# Altium schematic sheet Sheet2.SchDoc
size 840 x 594 mm; Scale: 1:1; Разраб.: Тимофеев; Обозначение документа: 5759-05-12-20 УП6359 Э3; Пров.: Никоноров; Утв.: Токарев; Наименование организации: ООО "ПО"Зарница"; Перв. применение: 5759-05-12-20 УП6359; Наименование изделия 1: Uni_mp3_v2_00; Наименование изделия 2: Схема электрическая; Наименование изделия 3: принципиальная; Нач. отд.: Нач. отд.; Фамилия нач. отд.: Никоноров
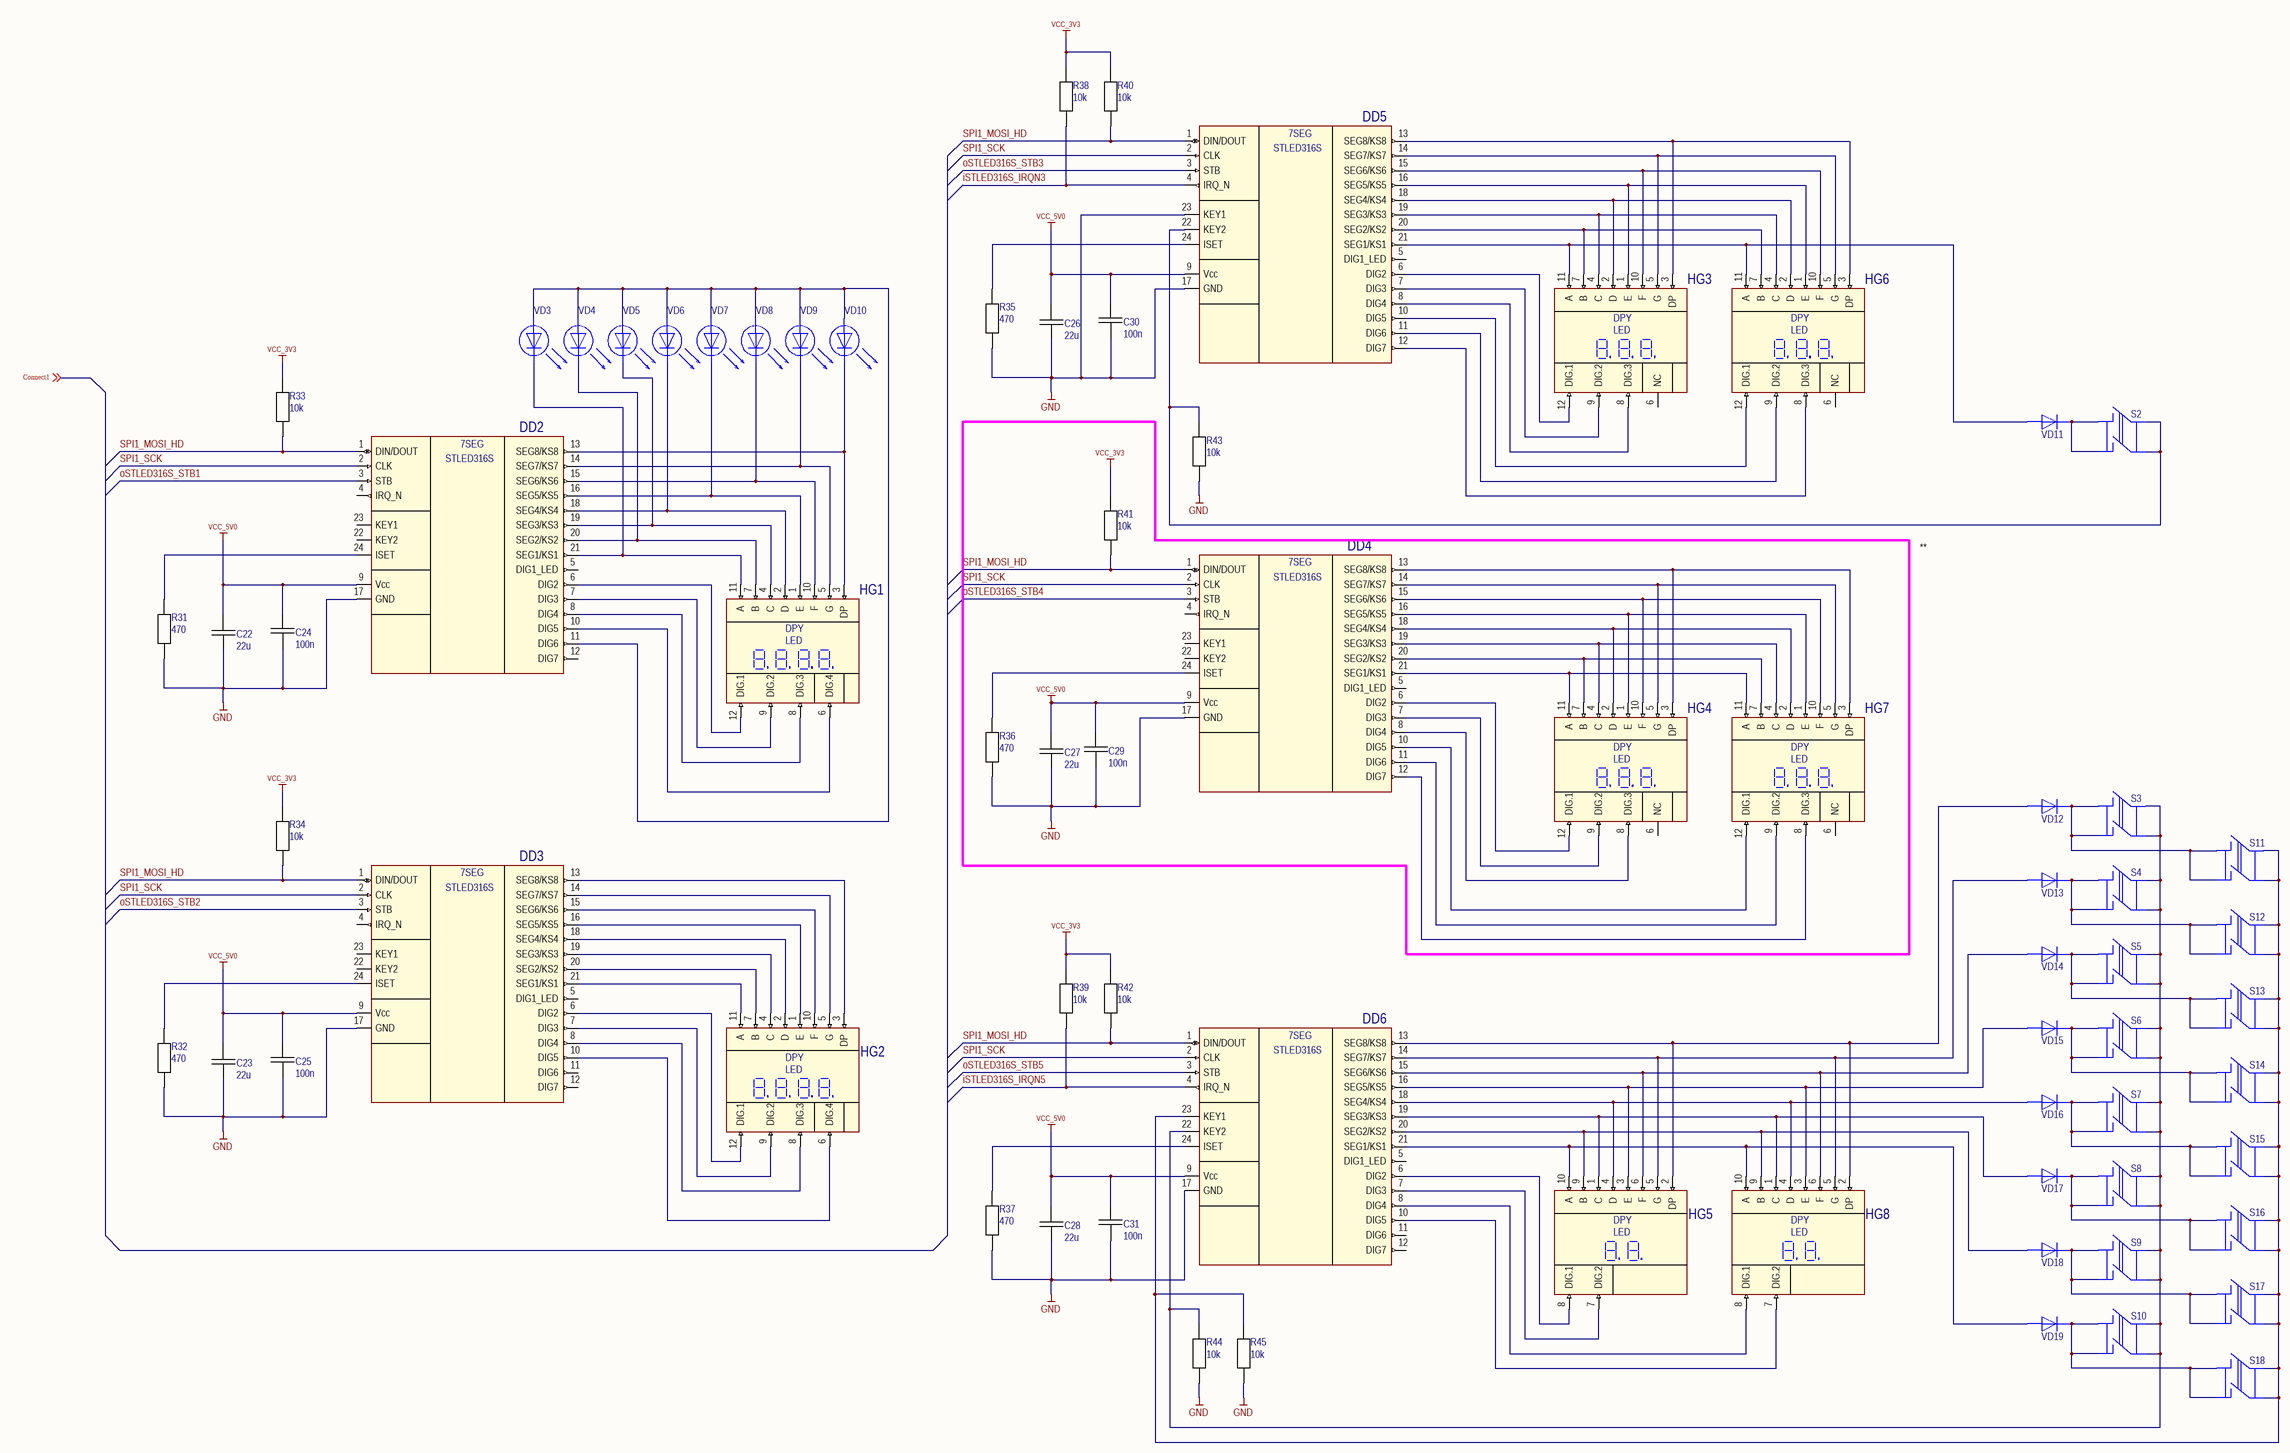
[diagram p0: Sheet2.SchDoc]

## Parts
C22  22u  [CAPACITOR_1206]
C23  22u  [CAPACITOR_1206]
C24  100n  [Capacitor_0805]
C25  100n  [Capacitor_0805]
C26  22u  [CAPACITOR_1206]
C27  22u  [CAPACITOR_1206]
C28  22u  [CAPACITOR_1206]
C29  100n  [Capacitor_0805]
C30  100n  [Capacitor_0805]
C31  100n  [Capacitor_0805]
DD2  STLED316S  [SO-24]  (value not drawn)
DD3  STLED316S  [SO-24]  (value not drawn)
DD4  STLED316S  [SO-24]  (value not drawn)
DD5  STLED316S  [SO-24]  (value not drawn)
DD6  STLED316S  [SO-24]  (value not drawn)
HG1  FYQ-5641BG-21  [FYQ-5641BG-21]  (value not drawn)
HG2  FYQ-5641BG-21  [FYQ-5641BG-21]  (value not drawn)
HG3  FYT-5631Bx  [FYT-5631Bx]  (value not drawn)
HG4  FYT-5631Bx  (value not drawn)
HG5  FYD-5621Bx  [FYD-5621Bx]  (value not drawn)
HG6  FYT-5631Bx  [FYT-5631Bx]  (value not drawn)
HG7  FYT-5631Bx  (value not drawn)
HG8  FYD-5621Bx  [FYD-5621Bx]  (value not drawn)
R31  470  [RESISTOR_SMD0805]
R32  470  [RESISTOR_SMD0805]
R33  10k  [RESISTOR_SMD0805]
R34  10k  [RESISTOR_SMD0805]
R35  470  [RESISTOR_SMD0805]
R36  470  [RESISTOR_SMD0805]
R37  470  [RESISTOR_SMD0805]
R38  10k  [RESISTOR_SMD0805]
R39  10k  [RESISTOR_SMD0805]
R40  10k  [RESISTOR_SMD0805]
R41  10k  [RESISTOR_SMD0805]
R42  10k  [RESISTOR_SMD0805]
R43  10k  [RESISTOR_SMD0805]
R44  10k  [RESISTOR_SMD0805]
R45  10k  [RESISTOR_SMD0805]
S2  DTS-26 12x12x9.5  [Tact Switch_DTS-26_12x12x95]  (value not drawn)
S3  DTS-26 12x12x9.5  [Tact Switch_DTS-26_12x12x95]  (value not drawn)
S4  DTS-26 12x12x9.5  [Tact Switch_DTS-26_12x12x95]  (value not drawn)
S5  DTS-26 12x12x9.5  [Tact Switch_DTS-26_12x12x95]  (value not drawn)
S6  DTS-26 12x12x9.5  [Tact Switch_DTS-26_12x12x95]  (value not drawn)
S7  DTS-26 12x12x9.5  [Tact Switch_DTS-26_12x12x95]  (value not drawn)
S8  DTS-26 12x12x9.5  [Tact Switch_DTS-26_12x12x95]  (value not drawn)
S9  DTS-26 12x12x9.5  [Tact Switch_DTS-26_12x12x95]  (value not drawn)
S10  DTS-26 12x12x9.5  [Tact Switch_DTS-26_12x12x95]  (value not drawn)
S11  DTS-26 12x12x9.5  [Tact Switch_DTS-26_12x12x95]  (value not drawn)
S12  DTS-26 12x12x9.5  [Tact Switch_DTS-26_12x12x95]  (value not drawn)
S13  DTS-26 12x12x9.5  [Tact Switch_DTS-26_12x12x95]  (value not drawn)
S14  DTS-26 12x12x9.5  [Tact Switch_DTS-26_12x12x95]  (value not drawn)
S15  DTS-26 12x12x9.5  [Tact Switch_DTS-26_12x12x95]  (value not drawn)
S16  DTS-26 12x12x9.5  [Tact Switch_DTS-26_12x12x95]  (value not drawn)
S17  DTS-26 12x12x9.5  [Tact Switch_DTS-26_12x12x95]  (value not drawn)
S18  DTS-26 12x12x9.5  [Tact Switch_DTS-26_12x12x95]  (value not drawn)
VD3  LED_FYL-3014GD1A  (value not drawn)
VD4  LED_FYL-3014GD1A  (value not drawn)
VD5  LED_FYL-3014GD1A  (value not drawn)
VD6  LED_FYL-3014GD1A  (value not drawn)
VD7  LED_FYL-3014GD1A  [LED_ FYL-3014GD1A]  (value not drawn)
VD8  LED_FYL-3014GD1A  [LED_ FYL-3014GD1A]  (value not drawn)
VD9  LED_FYL-3014GD1A  [LED_ FYL-3014GD1A]  (value not drawn)
VD10  LED_FYL-3014GD1A  [LED_ FYL-3014GD1A]  (value not drawn)
VD11  MMSD4148  [Diode_MMSD4148]  (value not drawn)
VD12  MMSD4148  [Diode_MMSD4148]  (value not drawn)
VD13  MMSD4148  [Diode_MMSD4148]  (value not drawn)
VD14  MMSD4148  [Diode_MMSD4148]  (value not drawn)
VD15  MMSD4148  [Diode_MMSD4148]  (value not drawn)
VD16  MMSD4148  [Diode_MMSD4148]  (value not drawn)
VD17  MMSD4148  [Diode_MMSD4148]  (value not drawn)
VD18  MMSD4148  [Diode_MMSD4148]  (value not drawn)
VD19  MMSD4148  [Diode_MMSD4148]  (value not drawn)

## Nets
GND: C22.2 C23.2 C24.1 C25.1 C26.2 C27.2 C28.2 C29.1 C30.1 C31.1 DD2.17(GND) DD3.17(GND) DD4.17(GND) DD5.17(GND) DD5.23(KEY1) DD6.17(GND) R31.1 R32.1 R35.1 R36.1 R37.1 R43.1 R44.1 R45.1
VCC_3V3: R33.2 R34.2 R38.2 R39.2 R40.2 R41.2 R42.2
VCC_5V0: C22.1 C23.1 C24.2 C25.2 C26.1 C27.1 C28.1 C29.2 C30.2 C31.2 DD2.9(Vcc) DD3.9(Vcc) DD4.9(Vcc) DD5.9(Vcc) DD6.9(Vcc)
iSTLED316S_IRQN3: DD5.4(IRQ_N) R38.1
iSTLED316S_IRQN5: DD6.4(IRQ_N) R39.1
oSTLED316S_STB1: DD2.3(STB)
oSTLED316S_STB2: DD3.3(STB)
oSTLED316S_STB3: DD5.3(STB)
oSTLED316S_STB4: DD4.3(STB)
oSTLED316S_STB5: DD6.3(STB)
SPI1_MOSI_HD: DD2.1(DIN/DOUT) DD3.1(DIN/DOUT) DD4.1(DIN/DOUT) DD5.1(DIN/DOUT) DD6.1(DIN/DOUT) R33.1 R34.1 R40.1 R41.1 R42.1
SPI1_SCK: DD2.2(CLK) DD3.2(CLK) DD4.2(CLK) DD5.2(CLK) DD6.2(CLK)
NetDD2_6: DD2.6(DIG2) HG1.12(DIG.1)
NetDD2_7: DD2.7(DIG3) HG1.9(DIG.2)
NetDD2_8: DD2.8(DIG4) HG1.8(DIG.3)
NetDD2_10: DD2.10(DIG5) HG1.6(DIG.4)
NetDD2_11: DD2.11(DIG6) VD3.2 VD4.2 VD5.2 VD6.2 VD7.2 VD8.2 VD9.2 VD10.2
NetDD2_13: DD2.13(SEG8/KS8) HG1.3(DP) VD10.1
NetDD2_14: DD2.14(SEG7/KS7) HG1.5(G) VD9.1
NetDD2_15: DD2.15(SEG6/KS6) HG1.10(F) VD8.1
NetDD2_16: DD2.16(SEG5/KS5) HG1.1(E) VD7.1
NetDD2_18: DD2.18(SEG4/KS4) HG1.2(D) VD6.1
NetDD2_19: DD2.19(SEG3/KS3) HG1.4(C) VD5.1
NetDD2_20: DD2.20(SEG2/KS2) HG1.7(B) VD4.1
NetDD2_21: DD2.21(SEG1/KS1) HG1.11(A) VD3.1
NetDD2_24: DD2.24(ISET) R31.2
NetDD3_6: DD3.6(DIG2) HG2.12(DIG.1)
NetDD3_7: DD3.7(DIG3) HG2.9(DIG.2)
NetDD3_8: DD3.8(DIG4) HG2.8(DIG.3)
NetDD3_10: DD3.10(DIG5) HG2.6(DIG.4)
NetDD3_13: DD3.13(SEG8/KS8) HG2.3(DP)
NetDD3_14: DD3.14(SEG7/KS7) HG2.5(G)
NetDD3_15: DD3.15(SEG6/KS6) HG2.10(F)
NetDD3_16: DD3.16(SEG5/KS5) HG2.1(E)
NetDD3_18: DD3.18(SEG4/KS4) HG2.2(D)
NetDD3_19: DD3.19(SEG3/KS3) HG2.4(C)
NetDD3_20: DD3.20(SEG2/KS2) HG2.7(B)
NetDD3_21: DD3.21(SEG1/KS1) HG2.11(A)
NetDD3_24: DD3.24(ISET) R32.2
NetDD4_6: DD4.6(DIG2) HG4.12(DIG.1)
NetDD4_7: DD4.7(DIG3) HG4.9(DIG.2)
NetDD4_8: DD4.8(DIG4) HG4.8(DIG.3)
NetDD4_10: DD4.10(DIG5) HG7.12(DIG.1)
NetDD4_11: DD4.11(DIG6) HG7.9(DIG.2)
NetDD4_12: DD4.12(DIG7) HG7.8(DIG.3)
NetDD4_13: DD4.13(SEG8/KS8) HG4.3(DP) HG7.3(DP)
NetDD4_14: DD4.14(SEG7/KS7) HG4.5(G) HG7.5(G)
NetDD4_15: DD4.15(SEG6/KS6) HG4.10(F) HG7.10(F)
NetDD4_16: DD4.16(SEG5/KS5) HG4.1(E) HG7.1(E)
NetDD4_18: DD4.18(SEG4/KS4) HG4.2(D) HG7.2(D)
NetDD4_19: DD4.19(SEG3/KS3) HG4.4(C) HG7.4(C)
NetDD4_20: DD4.20(SEG2/KS2) HG4.7(B) HG7.7(B)
NetDD4_21: DD4.21(SEG1/KS1) HG4.11(A) HG7.11(A)
NetDD4_24: DD4.24(ISET) R36.2
NetDD5_6: DD5.6(DIG2) HG3.12(DIG.1)
NetDD5_7: DD5.7(DIG3) HG3.9(DIG.2)
NetDD5_8: DD5.8(DIG4) HG3.8(DIG.3)
NetDD5_10: DD5.10(DIG5) HG6.12(DIG.1)
NetDD5_11: DD5.11(DIG6) HG6.9(DIG.2)
NetDD5_12: DD5.12(DIG7) HG6.8(DIG.3)
NetDD5_13: DD5.13(SEG8/KS8) HG3.3(DP) HG6.3(DP)
NetDD5_14: DD5.14(SEG7/KS7) HG3.5(G) HG6.5(G)
NetDD5_15: DD5.15(SEG6/KS6) HG3.10(F) HG6.10(F)
NetDD5_16: DD5.16(SEG5/KS5) HG3.1(E) HG6.1(E)
NetDD5_18: DD5.18(SEG4/KS4) HG3.2(D) HG6.2(D)
NetDD5_19: DD5.19(SEG3/KS3) HG3.4(C) HG6.4(C)
NetDD5_20: DD5.20(SEG2/KS2) HG3.7(B) HG6.7(B)
NetDD5_21: DD5.21(SEG1/KS1) HG3.11(A) HG6.11(A) VD11.2
NetDD5_22: DD5.22(KEY2) R43.2 S2.3 S2.4
NetDD5_24: DD5.24(ISET) R35.2
NetDD6_6: DD6.6(DIG2) HG5.8(DIG.1)
NetDD6_7: DD6.7(DIG3) HG5.7(DIG.2)
NetDD6_8: DD6.8(DIG4) HG8.8(DIG.1)
NetDD6_10: DD6.10(DIG5) HG8.7(DIG.2)
NetDD6_13: DD6.13(SEG8/KS8) HG5.2(DP) HG8.2(DP) VD12.2
NetDD6_14: DD6.14(SEG7/KS7) HG5.5(G) HG8.5(G) VD13.2
NetDD6_15: DD6.15(SEG6/KS6) HG5.6(F) HG8.6(F) VD14.2
NetDD6_16: DD6.16(SEG5/KS5) HG5.3(E) HG8.3(E) VD15.2
NetDD6_18: DD6.18(SEG4/KS4) HG5.4(D) HG8.4(D) VD16.2
NetDD6_19: DD6.19(SEG3/KS3) HG5.1(C) HG8.1(C) VD17.2
NetDD6_20: DD6.20(SEG2/KS2) HG5.9(B) HG8.9(B) VD18.2
NetDD6_21: DD6.21(SEG1/KS1) HG5.10(A) HG8.10(A) VD19.2
NetDD6_22: DD6.22(KEY2) R44.2 S3.3 S3.4 S4.3 S4.4 S5.3 S5.4 S6.3 S6.4 S7.3 S7.4 S8.3 S8.4 S9.3 S9.4 S10.3 S10.4
NetDD6_23: DD6.23(KEY1) R45.2 S11.3 S11.4 S12.3 S12.4 S13.3 S13.4 S14.3 S14.4 S15.3 S15.4 S16.3 S16.4 S17.3 S17.4 S18.3 S18.4
NetDD6_24: DD6.24(ISET) R37.2
NetS2_1: S2.1 S2.2 VD11.1
NetS3_1: S3.1 S3.2 S11.1 S11.2 VD12.1
NetS4_1: S4.1 S4.2 S12.1 S12.2 VD13.1
NetS5_1: S5.1 S5.2 S13.1 S13.2 VD14.1
NetS6_1: S6.1 S6.2 S14.1 S14.2 VD15.1
NetS7_1: S7.1 S7.2 S15.1 S15.2 VD16.1
NetS8_1: S8.1 S8.2 S16.1 S16.2 VD17.1
NetS9_1: S9.1 S9.2 S17.1 S17.2 VD18.1
NetS10_1: S10.1 S10.2 S18.1 S18.2 VD19.1

Not connected (* = marked no-connect by the designer): DD2 4(IRQ_N) 5(DIG1_LED) 12(DIG7) 22(KEY2) 23(KEY1); DD3 4(IRQ_N) 5(DIG1_LED) 11(DIG6) 12(DIG7) 22(KEY2) 23(KEY1); DD4 4(IRQ_N) 5(DIG1_LED) 22(KEY2) 23(KEY1); DD5 5(DIG1_LED); DD6 5(DIG1_LED) 11(DIG6) 12(DIG7); HG3 6(NC); HG4 6(NC); HG6 6(NC); HG7 6(NC)

## Notes on the sheet
- (near R40) ***
- (near R33) ***
- (near R41) ***
- **
- (near R34) ***
- Подп. и дата
- Инв. № дубл.
- Взам. инв. №
- Инв. № подл.
- Изм.
- Лист
- № докум.
- Подп.
- Дата
- Копировал
- Формат А1
- (in symbol FYD-5621Bx) DPY; LED
- (in symbol FYQ-5641BG-21) DPY; LED
- (in symbol FYT-5631Bx) DPY; LED
- (in symbol STLED316S) 7SEG

## Library data of the parts
C22 C23 C26-C28 = Capacitor_1206
C24 C25 C29-C31 = Capacitor_0805
R31-R45 = Resistor_0805
S2-S18 = Tact_Switch_DTS-26_12x12x95
VD11-VD19 = Diode_MMSD4148